# Altium schematic sheet 02-MCU.SchDoc
size A3
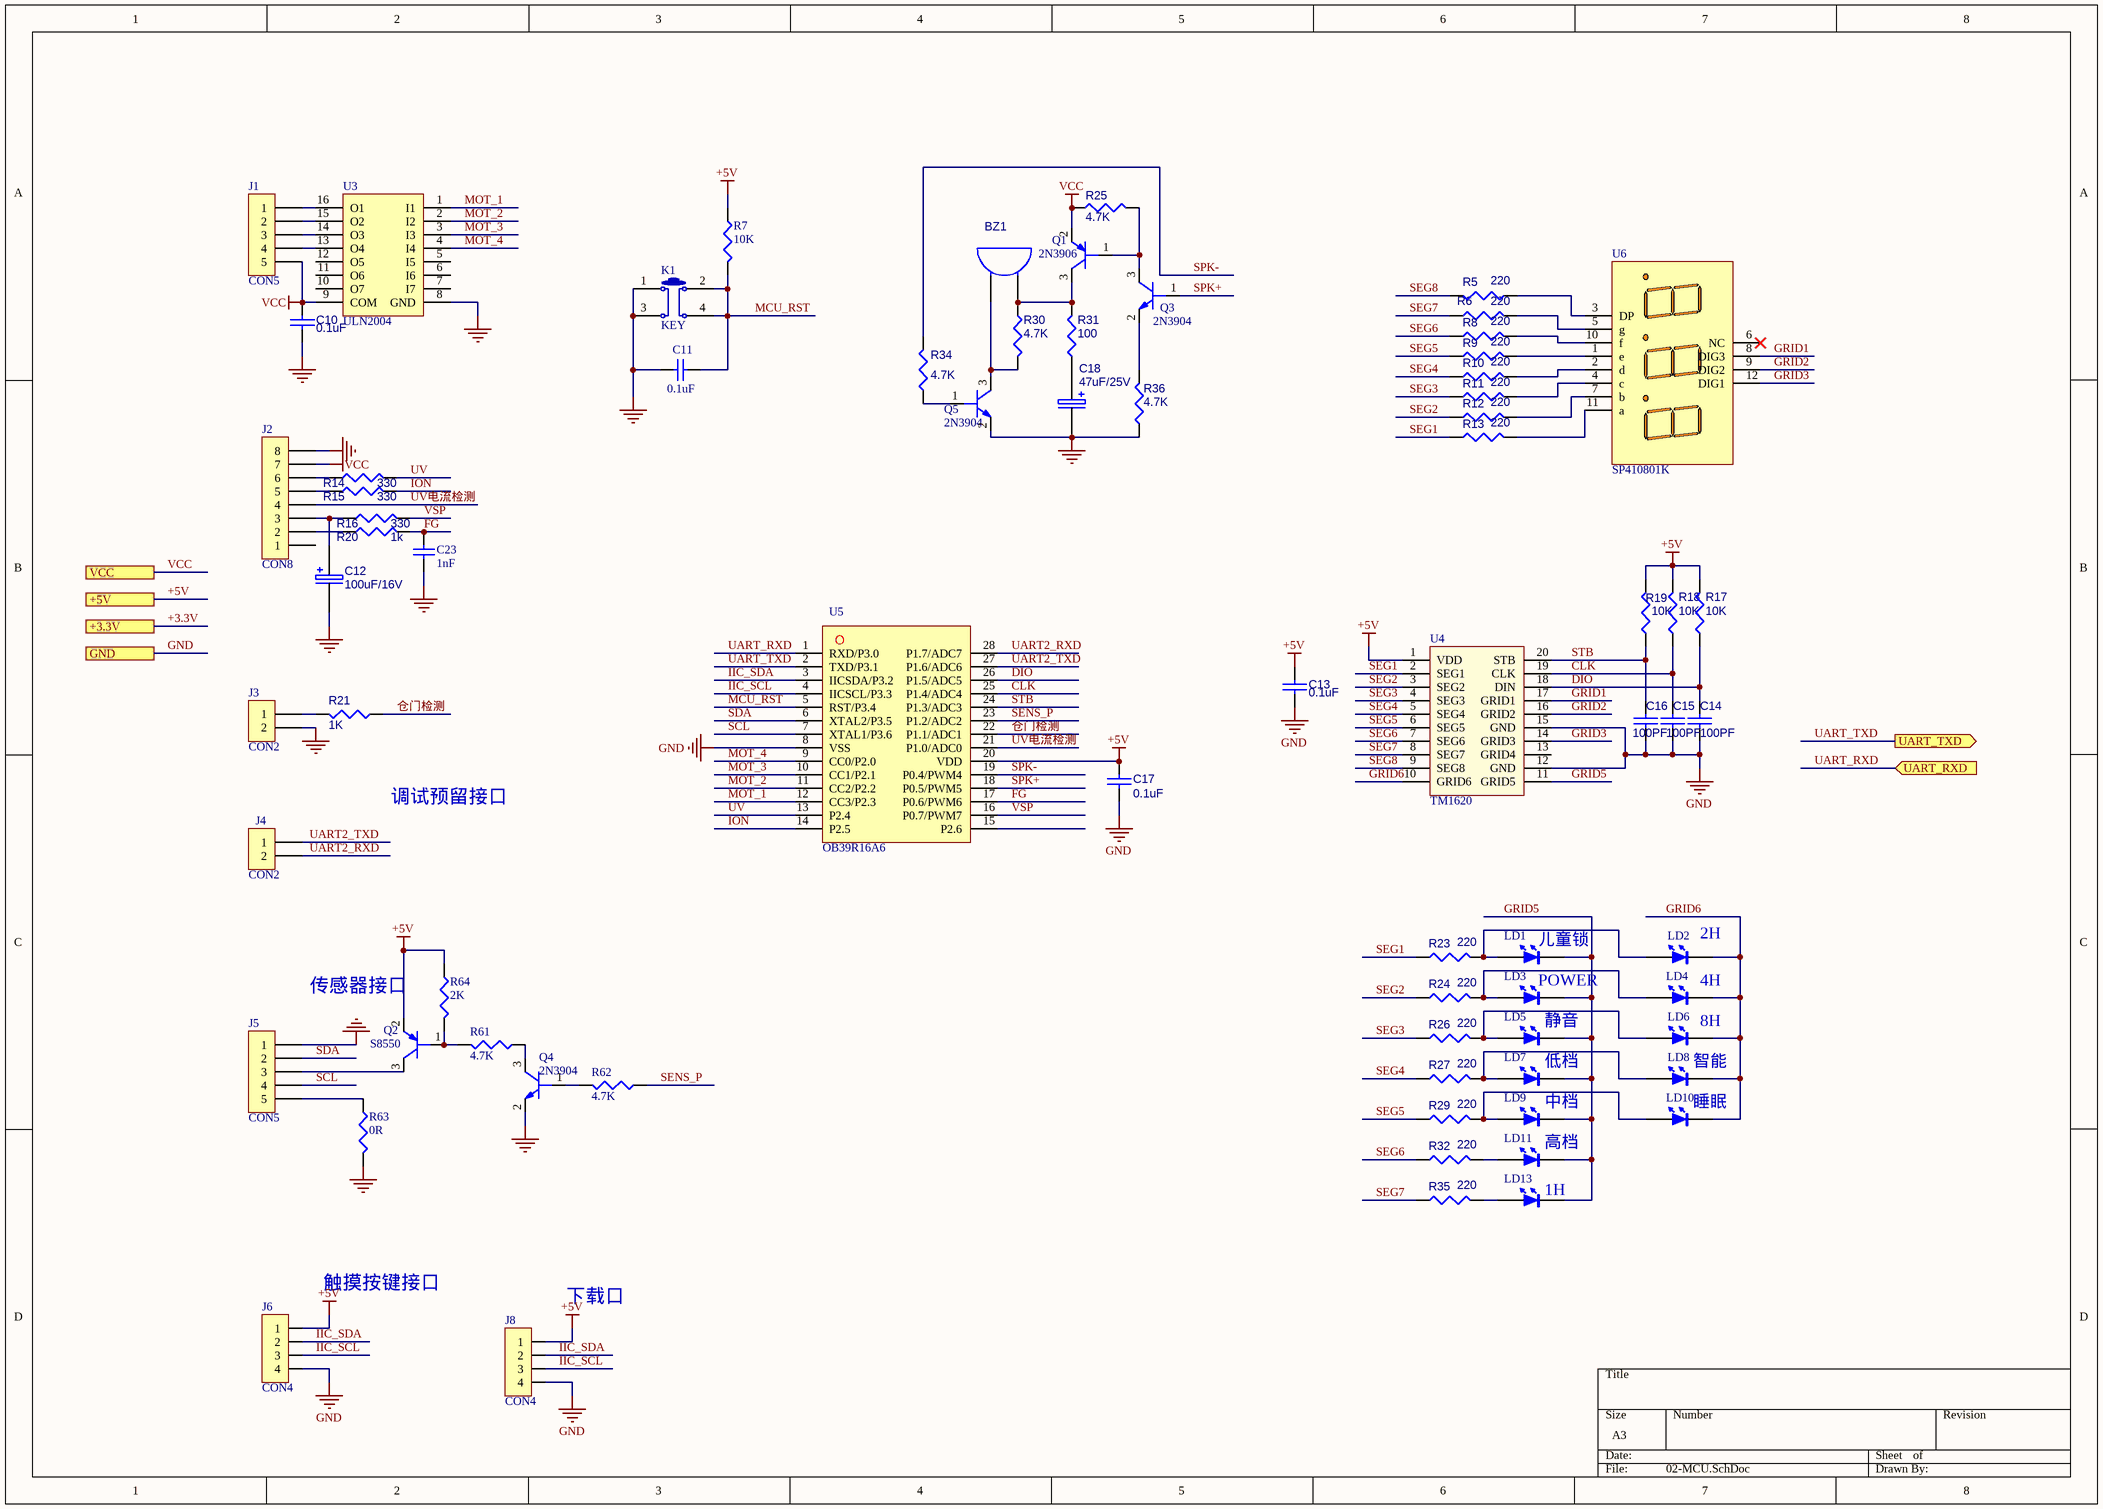
[diagram p0: 02-MCU.SchDoc]

## Parts
BZ1  BUZZER  [BUZ1]  (value not drawn)
C10  0.1uF  [0805_C]
C11  0.1uF  [0805_C]
C12  100uF/16V  [CE06150]
C13  0.1uF  [0805_C]
C14  100PF  [0805_C]
C15  100PF  [0805_C]
C16  100PF  [0805_C]
C17  0.1uF  [0805_C]
C18  47uF/25V  [CE06150 - W]
C23  1nF  [0805_C]
J1  CON5  [XH2.54-5PW]
J2  CON8  [XH2.54-8PW]
J3  CON2  [XH2.54-2PW]
J4  CON2  [SIP2]
J5  CON5  [XH2.54-5PW]
J6  CON4  [XH2.54-4PW]
J8  CON4  [SIP4]
K1  KEY  [KEY_SMD5465]
LD1  WHITE  [LED1]  (value not drawn)
LD2  WHITE  [LED1]  (value not drawn)
LD3  WHITE  [LED1]  (value not drawn)
LD4  WHITE  [LED1]  (value not drawn)
LD5  WHITE  [LED1]  (value not drawn)
LD6  WHITE  [LED1]  (value not drawn)
LD7  WHITE  [LED1]  (value not drawn)
LD8  WHITE  [LED1]  (value not drawn)
LD9  WHITE  [LED1]  (value not drawn)
LD10  WHITE  [LED1]  (value not drawn)
LD11  WHITE  [LED1]  (value not drawn)
LD13  WHITE  [LED1]  (value not drawn)
Q1  2N3906  [SOT23]
Q2  S8550  [SOT23]
Q3  2N3904  [SOT23]
Q4  2N3904  [SOT23]
Q5  2N3904  [SOT23]
R5  220  [0805_R]
R6  220  [0805_R]
R7  10K  [0805_R]
R8  220  [0805_R]
R9  220  [0805_R]
R10  220  [0805_R]
R11  220  [0805_R]
R12  220  [0805_R]
R13  220  [0805_R]
R14  330  [0805_R]
R15  330  [0805_R]
R16  330  [0805_R]
R17  10K  [0805_R]
R18  10K  [0805_R]
R19  10K  [0805_R]
R20  1k  [0805_R]
R21  1K  [0805_R]
R23  220  [0805_R]
R24  220  [0805_R]
R25  4.7K  [0805_R]
R26  220  [0805_R]
R27  220  [0805_R]
R29  220  [0805_R]
R30  4.7K  [0805_R]
R31  100  [0805_R]
R32  220  [0805_R]
R34  4.7K  [0805_R]
R35  220  [0805_R]
R36  4.7K  [0805_R]
R61  4.7K  [0805_R]
R62  4.7K  [0805_R]
R63  0R  [0805_R]
R64  2K  [0805_R]
U3  ULN2004  [SOP16]
U4  TM1620  [SOP20]
U5  OB39R16A6  [SOP28]
U6  SP410801K  [LED08031]

## Ports
+3.3V, +5V, GND, UART_RXD (in), UART_TXD (out), VCC

## Nets
+5V: C13.1 C17.1 J6.1 J8.1 Q2.2(EMITTER) R7.2 R17.1 R18.1 R19.1 R64.1 U4.1(VDD) U5.20(VDD) ; port +5V
GND: C10.2 C11.1 C12.2(-) C13.2 C14.2 C15.2 C16.2 C17.2 C18.2(-) C23.1 J2.8 J3.2 J5.1 J6.4 J8.4 K1.1 K1.3 Q4.2(EMITTER) Q5.2(EMITTER) R36.1 R63.2 U3.8(GND) U4.12(GND) U4.15(GND) U5.8(VSS) ; port GND
VCC: C10.1 J1.5 J2.7 Q1.2(EMITTER) R25.1 U3.9(COM) ; port VCC
+3.3V: port +3.3V
CLK: C15.1 R18.2 U4.19(CLK) U5.25(P1.4/ADC4)
DIO: C14.1 R17.2 U4.18(DIN) U5.26(P1.5/ADC5)
FG: C23.2 R20.1 U5.17(P0.6/PWM6)
GRID1: U4.17(GRID1) U6.8(DIG3)
GRID2: U4.16(GRID2) U6.9(DIG2)
GRID3: U4.14(GRID3) U6.12(DIG1)
GRID5: LD1.K LD3.K LD5.K LD7.K LD9.K LD11.K LD13.K U4.11(GRID5)
GRID6: LD2.K LD4.K LD6.K LD8.K LD10.K U4.10(GRID6)
IIC_SCL: J6.3 J8.3 U5.4(IICSCL/P3.3)
IIC_SDA: J6.2 J8.2 U5.3(IICSDA/P3.2)
ION: R15.1 U5.14(P2.5)
MCU_RST: C11.2 K1.2 K1.4 R7.1 U5.5(RST/P3.4)
MOT_1: U3.1(I1) U5.12(CC3/P2.3)
MOT_2: U3.2(I2) U5.11(CC2/P2.2)
MOT_3: U3.3(I3) U5.10(CC1/P2.1)
MOT_4: U3.4(I4) U5.9(CC0/P2.0)
SCL: J5.4 U5.7(XTAL1/P3.6)
SDA: J5.2 U5.6(XTAL2/P3.5)
SEG1: R13.1 R23.1 U4.2(SEG1)
SEG2: R12.1 R24.1 U4.3(SEG2)
SEG3: R11.1 R26.1 U4.4(SEG3)
SEG4: R10.1 R27.1 U4.5(SEG4)
SEG5: R9.1 R29.1 U4.6(SEG5)
SEG6: R8.1 R32.1 U4.7(SEG6)
SEG7: R6.1 R35.1 U4.8(SEG7)
SEG8: R5.1 U4.9(SEG8)
SENS_P: R62.1 U5.23(P1.2/ADC2)
SPK+: Q3.1(BASE) U5.18(P0.5/PWM5)
SPK-: R34.2 U5.19(P0.4/PWM4)
STB: C16.1 R19.2 U4.20(STB) U5.24(P1.3/ADC3)
UART2_RXD: J4.2 U5.28(P1.7/ADC7)
UART2_TXD: J4.1 U5.27(P1.6/ADC6)
UART_RXD: U5.1(RXD/P3.0) ; port UART_RXD
UART_TXD: U5.2(TXD/P3.1) ; port UART_TXD
UV: R14.1 U5.13(P2.4)
UV电流检测: J2.4 U5.21(P1.0/ADC0)
VSP: R16.1 U5.16(P0.7/PWM7)
仓门检测: R21.1 U5.22(P1.1/ADC1)
NetBZ1_1: BZ1.1(A) Q1.3(COLLECTOR) R30.1 R31.2
NetBZ1_2: BZ1.2(B) Q5.3(COLLECTOR) R30.2
NetC12_1: C12.1(+) J2.3 R16.2
NetC18_1: C18.1(+) R31.1
NetJ1_1: J1.1 U3.16(O1)
NetJ1_2: J1.2 U3.15(O2)
NetJ1_3: J1.3 U3.14(O3)
NetJ1_4: J1.4 U3.13(O4)
NetJ2_2: J2.2 R20.2
NetJ2_5: J2.5 R15.2
NetJ2_6: J2.6 R14.2
NetJ3_1: J3.1 R21.2
NetJ5_3: J5.3 Q2.3(COLLECTOR)
NetJ5_5: J5.5 R63.1
NetLD1_A: LD1.A LD2.A R23.2
NetLD3_A: LD3.A LD4.A R24.2
NetLD5_A: LD5.A LD6.A R26.2
NetLD7_A: LD7.A LD8.A R27.2
NetLD9_A: LD9.A LD10.A R29.2
NetLD11_A: LD11.A R32.2
NetLD13_A: LD13.A R35.2
NetQ1_1: Q1.1(BASE) Q3.3(COLLECTOR) R25.2
NetQ2_1: Q2.1(BASE) R61.2 R64.2
NetQ3_2: Q3.2(EMITTER) R36.2
NetQ4_1: Q4.1(BASE) R62.2
NetQ4_3: Q4.3(COLLECTOR) R61.1
NetQ5_1: Q5.1(BASE) R34.1
NetR5_2: R5.2 U6.3(DP)
NetR6_2: R6.2 U6.5(g)
NetR8_2: R8.2 U6.10(f)
NetR9_2: R9.2 U6.1(e)
NetR10_2: R10.2 U6.2(d)
NetR11_2: R11.2 U6.4(c)
NetR12_2: R12.2 U6.7(b)
NetR13_2: R13.2 U6.11(a)

Not connected (* = marked no-connect by the designer): J2 1; U3 5(I5) 6(I6) 7(I7) 10(O7) 11(O6) 12(O5); U4 13(GRID4); U5 15(P2.6); U6 6(NC)*

## Notes on the sheet
- 调试预留接口
- (near J5) 传感器接口
- (near LD1) 儿童锁
- (near LD3) POWER
- (near LD2) 2H
- 4H
- 静音
- 8H
- 低档
- 中档
- 智能
- 睡眠
- 高档
- (near LD13) 1H
- (near J6) 触摸按键接口
- (near J8) 下载口

## Library data of the parts
C10 C13-C17 = CAP
C11 = Cap: Capacitor; Published: 8-Jun-2000; LatestRevisionDate: 17-Jul-2002; LatestRevisionNote: Re-released for DXP Platform.; PackageReference: RAD-0.3; Publisher: Altium Limited; Value: 0.1UF
C12 C18 = ECAP: E-CAP
C23 = Cap: Capacitor; Value: 0.1UF; Published: 8-Jun-2000; LatestRevisionDate: 17-Jul-2002; LatestRevisionNote: Re-released for DXP Platform.; PackageReference: RAD-0.3; Publisher: Altium Limited
J1 J5 = CON6: Connector
J3 J4 = CON2: Connector
LD1-LD11 LD13 = LED
Q1 Q2 = PNP
Q3-Q5 = NPN
R5 R6 R8-R21 R23-R27 R29-R32 R34-R36 = R0.25W: RESISTOR
R7 = Res3: Resistor; Published: 8-Jun-2000; LatestRevisionDate: 04-Mar-2005; LatestRevisionNote: PCB Footprint replaced.; PackageReference: J1-0603; Publisher: Altium Limited; Value: 10K
R61-R64 = RES1
U5 = OB39R08A2: 36 Pin AT Connector